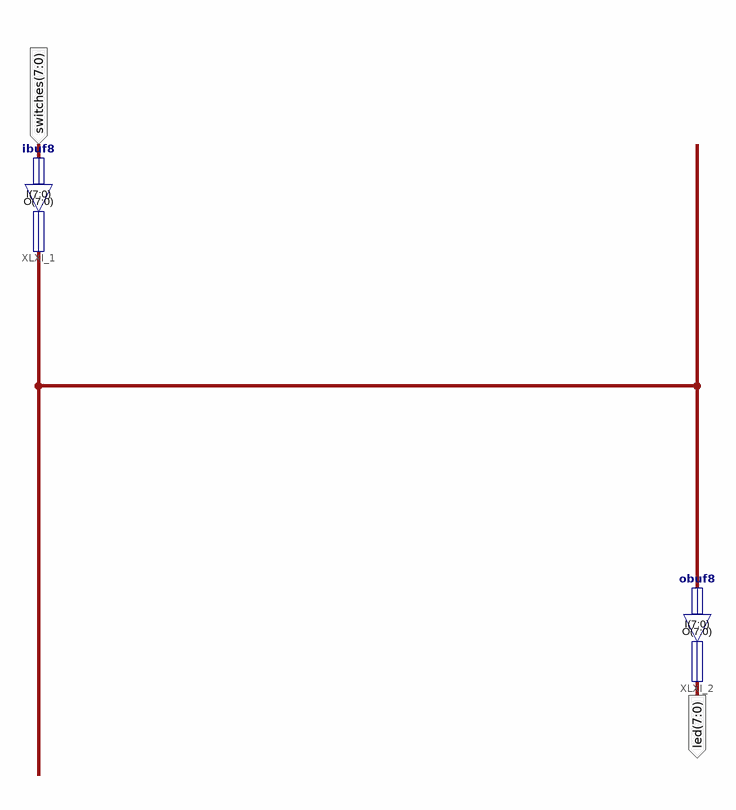
[diagram p0: schematic sheet 1]
// Xilinx ISE schematic toplevel.sch (spartan6) as structural Verilog: 2 symbols, 2 ports
module toplevel (
  input  [7:0] switches,
  output [7:0] led
);

  wire [7:0] XLXN_2;

  ibuf8 XLXI_1 (.I(switches), .O(XLXN_2));
  obuf8 XLXI_2 (.I(XLXN_2), .O(led));
endmodule
